# EAGLE design FV1 Touch (EAGLE 8.3.2)
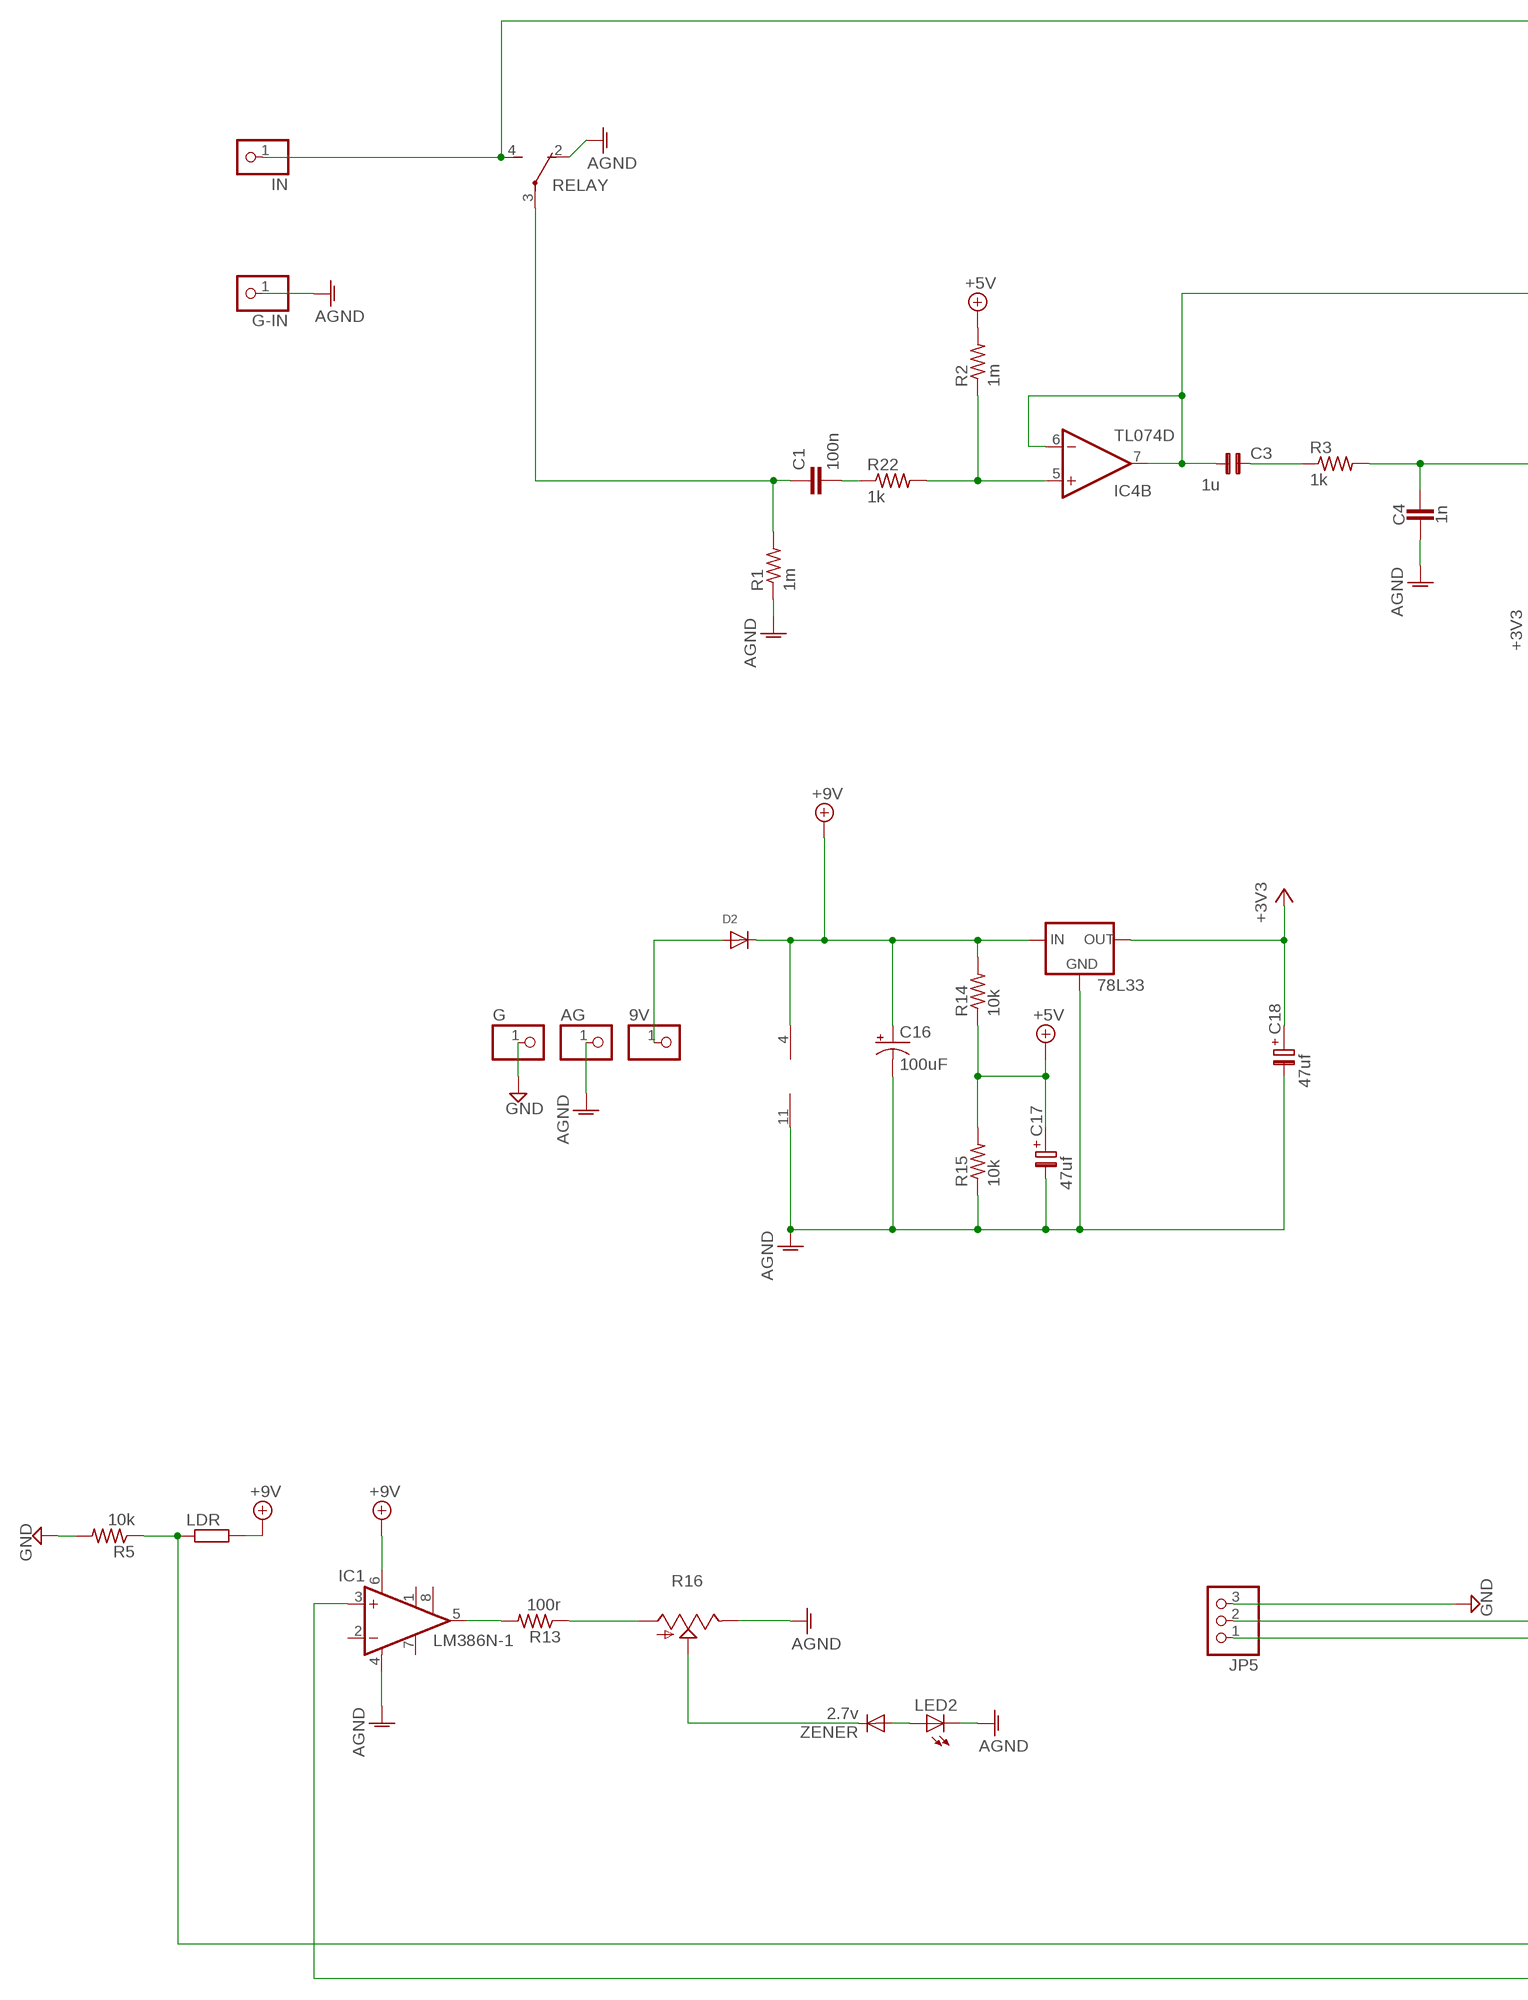
[diagram p0: schematic, sheet 1, part 1 of 2]
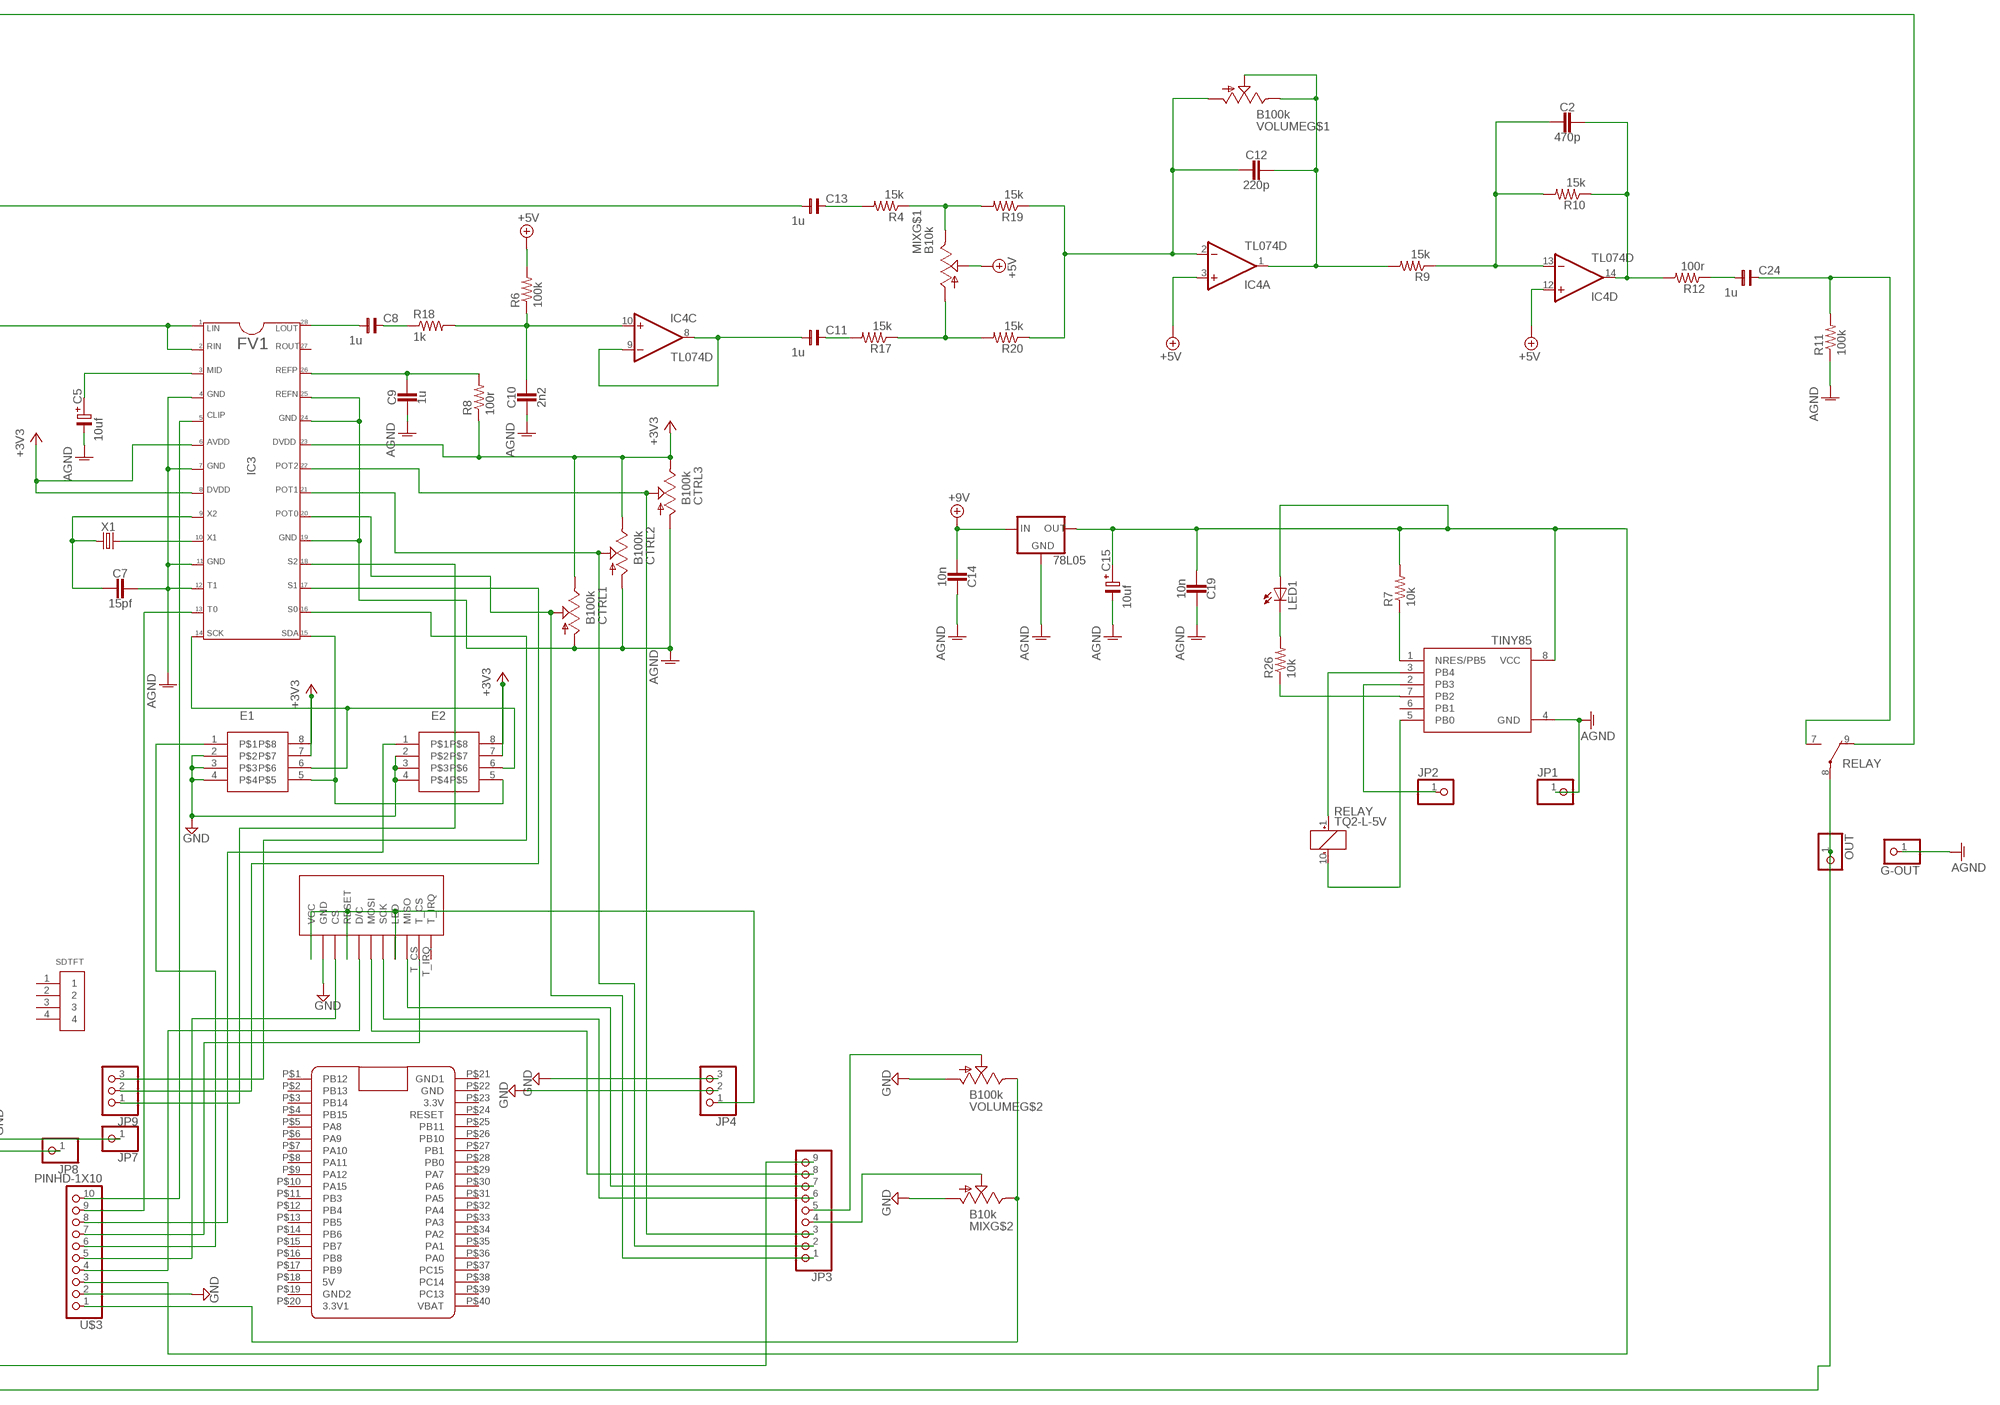
[diagram p1: schematic, sheet 1, part 2 of 2]

## Parts
9V  PINHD-1X1  [1X01]
78L05  78LXX-SOT89  [SOT89]
78L33  78LXX-SOT89  [SOT89]
AG  PINHD-1X1  [1X01]
C1  100n  C5/3  [C5B3]
C2  470p  CAP1206  [RESISTOR_C1206]
C3  1u  C-NP-5,0-7,5X3,0  [C5,0-7,5X3,0]
C4  1n  CAP1206  [RESISTOR_C1206]
C5  10uf  C-PR-SMD-SV-C  [SV-C]
C7  15pf  CAP1206  [RESISTOR_C1206]
C8  1u  C-NP-5,0-7,5X3,0  [C5,0-7,5X3,0]
C9  1u  CAP1206  [RESISTOR_C1206]
C10  2n2  CAP1206  [RESISTOR_C1206]
C11  1u  C-NP-5,0-7,5X3,0  [C5,0-7,5X3,0]
C12  220p  CAP1206  [RESISTOR_C1206]
C13  1u  C-NP-5,0-7,5X3,0  [C5,0-7,5X3,0]
C14  10n  CAP1206  [RESISTOR_C1206]
C15  10uf  C-PR-SMD-SV-C  [SV-C]
C16  100uF  100UF-POLAR-25V-20%(ELEC)  [PANASONIC_D]
C17  47uf  C-PR-SMD-SV-C  [SV-C]
C18  47uf  C-PR-SMD-SV-C  [SV-C]
C19  10n  CAP1206  [RESISTOR_C1206]
C24  1u  C-NP-5,0-7,5X3,0  [C5,0-7,5X3,0]
CTRL1  B100k  9MM_SNAP-IN_POT_  [9MM_SNAP-IN_POT]
CTRL2  B100k  9MM_SNAP-IN_POT_  [9MM_SNAP-IN_POT]
CTRL3  B100k  9MM_SNAP-IN_POT_  [9MM_SNAP-IN_POT]
D2  DIODESOD-123  [SOD-123]
E1  -EEPROM  [SOCKED-08]
E2  -EEPROM  [SOCKED-08]
G  PINHD-1X1  [1X01]
G-IN  PINHD-1X1  [1X01]
G-OUT  PINHD-1X1  [1X01]
IC1  LM386N-1  [DIL08]
IC3  FV1  [SO1C28]
IC4  TL074D  [SO14]
IN  PINHD-1X1  [1X01]
J1  SPI_TFT_DISPLAY_TOUCH  [SPI_DISPLAY_TOUCH]
JP1  PINHD-1X1CB  [1X01-CLEANBIG]
JP2  PINHD-1X1CB  [1X01-CLEANBIG]
JP3  PINHD-1X9  [1X09-BIG]
JP4  PINHD-1X3  [1X03]
JP5  PINHD-1X3  [1X03]
JP7  PINHD-1X1  [1X01]
JP8  PINHD-1X1  [1X01]
JP9  PINHD-1X3  [1X03]
LDR  R-EU_0204/5  [0204/5]
LED1  LED5MM  [LED5MM]
LED2  LED5MM  [LED5MM]
MIX  B10k  ALPHA-9MM-DUALPOT  [DUAL_9MM_SNAP-IN_POT]
OUT  PINHD-1X1  [1X01]
R1  1m  R-US_R0805  [R0805]
R2  1m  R-US_R0805  [R0805]
R3  1k  R-US_R0805  [R0805]
R4  15k  R-US_R0805  [R0805]
R5  10k  R-US_R0805  [R0805]
R6  100k  R-US_R0805  [R0805]
R7  10k  R-US_R0805  [R0805]
R8  100r  R-US_R0805  [R0805]
R9  15k  R-US_R0805  [R0805]
R10  15k  R-US_R0805  [R0805]
R11  100k  R-US_R0805  [R0805]
R12  100r  R-US_R0805  [R0805]
R13  100r  R-US_R0805  [R0805]
R14  10k  R-US_R0805  [R0805]
R15  10k  R-US_R0805  [R0805]
R16  TRIM_US-B25P  [B25P]
R17  15k  R-US_R0805  [R0805]
R18  1k  R-US_R0805  [R0805]
R19  15k  R-US_R0805  [R0805]
R20  15k  R-US_R0805  [R0805]
R22  1k  R-US_R0805  [R0805]
R26  10k  R-US_R0805  [R0805]
RELAY  TQ2-L-5V  TQ2-5V  [TQ2]
SDTFT  1X4-BIG  [1X04-BIG]
TINY85  ATTINY85-20P  [PDIP08_300MIL]
U$1  BLUE_PILL  [BLUE_PILL]
U$3  PINHD-1X10  [1X10-BIG]
VOLUME  B100k  ALPHA-9MM-DUALPOT  [DUAL_9MM_SNAP-IN_POT]
X1  CRYSTALPTH-2X6-KIT  [CRYSTAL-PTH-2X6-CYL-KIT]
ZENER  2.7v  SMALL_DIODEDO35-7  [DO35-7]

## Nets
+3V3: 78L33.1(OUT) C18.+ CTRL1.3(E) CTRL2.3(E) CTRL3.3(E) E1.7 E1.8 E2.7 E2.8 IC3.6 IC3.8 IC3.23 R8.1
+5V: C17.+ IC4.3(A:+IN) IC4.12(D:+IN) MIX.2(S) R2.2 R6.2 R14.1 R15.2
+9V: 78L05.3(IN) 78L33.3(IN) C14.2 C16.+ D2.C IC1.6(VS) IC4.4(P:V+) LDR.2 R14.2
AGND: 78L05.2(GND) 78L33.2(GND) AG.1 C4.2 C5.- C7.1 C9.2 C10.2 C14.1 C15.- C16.- C17.- C18.- C19.1 CTRL1.1(A) CTRL2.1(A) CTRL3.1(A) G-IN.1 G-OUT.1 IC1.4(GND) IC3.4 IC3.7 IC3.11 IC3.12 IC3.19 IC3.24 IC3.25 IC4.11(P:V-) JP1.1 LED2.K(C) R1.1 R11.1 R15.1 R16.E RELAY.2(1:O) TINY85.4(GND)
GND: E1.2 E1.3 E1.4 E2.2 E2.3 E2.4 G.1 J1.GND JP4.2 JP4.3 JP5.3 MIX.1B(A) R5.2 U$3.2 VOLUME.1B(A)
N$1: C1.2 R22.1
N$2: IC4.5(B:+IN) R2.1 R22.2
N$3: C3.1 C13.1 IC4.6(B:-IN) IC4.7(B:OUT)
N$4: C8.1 IC3.28
N$5: C4.1 IC3.1 IC3.2 R3.2
N$6: C8.2 R18.1
N$7: C3.2 R3.1
N$8: C10.1 IC4.10(C:+IN) R6.1 R18.2
N$9: C11.1 IC4.8(C:OUT) IC4.9(C:-IN)
N$10: C11.2 R17.2
N$11: MIX.1(A) R17.1 R20.2
N$12: C24.2 R11.2 RELAY.7(2:S)
N$13: MIX.3(E) R4.1 R19.2
N$14: C13.2 R4.2
N$15: C2.1 IC4.14(D:OUT) R10.1 R12.2
N$16: C24.1 R12.1
N$17: C1.1 R1.2 RELAY.3(1:P)
N$18: C12.2 IC4.2(A:-IN) R19.1 R20.1 VOLUME.1(A)
N$19: C2.2 IC4.13(D:-IN) R9.1 R10.2
N$20: C12.1 IC4.1(A:OUT) R9.2 VOLUME.2(S) VOLUME.3(E)
N$21: J1.CS U$3.5
N$22: J1.D/C U$3.4
N$23: J1.MOSI J1.T_MOSI(MOSI) JP3.8
N$24: C5.+ IC3.3
N$25: IC3.13 U$3.9
N$26: CTRL3.2(S) IC3.22 JP3.3
N$27: C7.2 IC3.9 X1.1
N$28: C9.1 IC3.26 R8.2
N$29: CTRL2.2(S) IC3.21 JP3.2
N$30: CTRL1.2(S) IC3.20 JP3.1
N$31: J1.SCK J1.T_SCK(SCK) JP3.6
N$32: J1.MISO J1.T_MISO(MISO) JP3.7
N$33: IC3.10 X1.2
N$34: J1.T_CS U$3.7
N$35: JP5.2 JP7.1
N$36: E1.6 E2.6 IC3.14
N$37: E1.5 E2.5 IC3.15
N$38: JP5.1 JP8.1
N$39: J1.LED J1.RESET J1.VCC JP4.1
N$40: IC3.17 JP9.2
N$41: 9V.1 D2.A
N$42: IC3.18 JP9.1
N$43: E1.1 U$3.6
N$44: JP3.4 MIX.2B(S)
N$45: 78L05.1(OUT) C15.+ C19.2 LED1.A R7.2 TINY85.8(VCC) U$3.3
N$46: RELAY.1(_:+) TINY85.3(PB4)
N$47: R7.1 TINY85.1(NRES/PB5)
N$48: RELAY.10(_:-) TINY85.5(PB0)
N$49: JP2.1 TINY85.2(PB3)
N$50: R26.1 TINY85.7(PB2)
N$51: LED1.K(C) R26.2
N$52: IN.1 RELAY.4(1:S) RELAY.9(2:O)
N$53: IC1.3(+IN) OUT.1 RELAY.8(2:P)
N$54: JP3.5 VOLUME.2B(S)
N$55: IC3.16 JP9.3
N$56: MIX.3B(E) U$3.1 VOLUME.3B(E)
N$57: R16.S ZENER.C
N$59: E2.1 U$3.8
N$80: IC3.5 U$3.10
N$82: IC1.5(OUT) R13.2
N$83: R13.1 R16.A
N$84: LED2.A ZENER.A
N$87: JP3.9 LDR.1 R5.1
Unconnected: IC1.1(GAIN) IC1.2(-IN) IC1.7(BYPASS) IC1.8(GAIN) IC3.27 J1.T_IRQ SDTFT.1 SDTFT.2 SDTFT.3 SDTFT.4 TINY85.6(PB1) U$1.P$1(PB12) U$1.P$2(PB13) U$1.P$3(PB14) U$1.P$4(PB15) U$1.P$5(PA8) U$1.P$6(PA9) U$1.P$7(PA10) U$1.P$8(PA11) U$1.P$9(PA12) U$1.P$10(PA15) U$1.P$11(PB3) U$1.P$12(PB4) U$1.P$13(PB5) U$1.P$14(PB6) U$1.P$15(PB7) U$1.P$16(PB8) U$1.P$17(PB9) U$1.P$18(5V) U$1.P$19(GND2) U$1.P$20(3.3V1) U$1.P$22(GND) U$1.P$23(3.3V) U$1.P$24(RESET) U$1.P$25(PB11) U$1.P$26(PB10) U$1.P$27(PB1) U$1.P$28(PB0) U$1.P$29(PA7) U$1.P$30(PA6) U$1.P$31(PA5) U$1.P$32(PA4) U$1.P$33(PA3) U$1.P$34(PA2) U$1.P$35(PA1) U$1.P$36(PA0) U$1.P$37(PC15) U$1.P$38(PC14) U$1.P$39(PC13) U$1.P$40(VBAT)

## Power pins joined to a net without a drawn wire
GND1: U$1.P$21(GND1)

## Library data of the parts
9V AG G G-IN G-OUT IN JP1 JP2 JP7 JP8 OUT = adafruit:PINHD-1X1: Pin header 1x1 for 0.1" spacing With round pins
78L05 78L33 = v-reg-3:78LXX: VOLTAGE REGULATOR
C1 = capacitor-wima:C: CAPACITOR naming: grid - package width
C2 C4 C7 C9 C10 C12 C14 C19 = SMD:CAP
C3 C8 C11 C13 C24 = cap-pan40:C-NP: NON-POLARIZED FILM/CHIP
C5 C15 C17 C18 = cap-pan40:C-PR: POLARIZED ELECTROLYTIC/TANTALUM
C16 = SparkFun-Capacitors:100UF-POLAR: 100µF polarized capacitors A capacitor is a passive two-terminal electrical component used to store electrical energy temporarily in an electric field.; PROD_ID: CAP-12547
CTRL1-CTRL3 = MusicThingModular:9MM_SNAP-IN_POT: 9mm vertical snap-in pot, Alpha / Panasonic style
D2 = adafruit:DIODE: Diode SMADIODE - SMA Surface Mount Package 20V 1A Schottky Diode Digikey: 641-1014-6-ND DO-1N4148 - Through Hole Small Current Diode SOD-123 20V 1 A (.5mV Vf) Schottky Diode - Digikey: MBRX120TPMSCT-ND SOD-323 10V 570mA (.38mV Vf, 3ns) Schottky Diode - Digikey: ZLLS410CT-ND SOD-523 30V 30mA Schottky Diode (RB751S-40TE61) - Digikey: RB751S-40TE61CT-ND SOT23-R/W - SOT23 Package (R = Solder Paste/Reflow Ovens, W = Hand-Soldering) BAT54Film 40V 300mA - Digikey: 497-7162-1-ND
E1 E2 = tango:-EEPROM
IC1 = linear:LM386?-*: Low Voltage Audio Power Amplifier Source: http://cache.national.com/ds/LM/LM386.pdf
IC3 = integrated circuits:FV1
IC4 = gm-ics:TL074: OP AMP
J1 = kanflo:SPI_TFT_DISPLAY_TOUCH: SPI TFT Display with touch Connector for the cheap 2.4"/2.8" Serial SPI TFT displays with touch found on eBay.
JP3 = adafruit:PINHD-1X9: Pin header 1x10 0.1" spacing With round pins
JP4 JP5 JP9 = adafruit:PINHD-1X3: PIN HEADER
LDR = resistor:R-EU_: RESISTOR, European symbol
LED1 LED2 = adafruit:LED: LED OSRAM: - CHIPLED LG R971, LG N971, LY N971, LG Q971, LY Q971, LO R971, LY R971 LH N974, LH R974 LS Q976, LO Q976, LY Q976 LO Q996 - Hyper CHIPLED LW Q18S LB Q993, LB Q99A, LB R99A - SideLED LS A670, LO A670, LY A670, LG A670, LP A670 LB A673, LV A673, LT A673, LW A673 LH A674 LY A675 LS A676, LA A676, LO A676, LY A676, LW A676 LS A679, LY A679, LG A679 - Hyper Micro SIDELED® LS Y876, LA Y876, LO Y876, LY Y876 LT Y87S - SmartLED LW L88C, LW L88S LB L89C, LB L89S, LG L890 LS L89K, LO L89K, LY L89K LS L896, LA L896, LO L896, LY L896 - TOPLED LS T670, LO T670, LY T670, LG T670, LP T670 LSG T670, LSP T670, LSY T670, LOP T670, LYG T670 LG T671, LOG T671, LSG T671 LB T673, LV T673, LT T673, LW T673 LH T674 LS T676, LA T676, LO T676, LY T676, LB T676, LH T676, LSB T676, LW T676 LB T67C, LV T67C, LT T67C, LS T67K, LO T67K, LY T67K, LW E67C LS E67B, LA E67B, LO E67B, LY E67B, LB E67C, LV E67C, LT E67C LW T67C LS T679, LY T679, LG T679 LS T770, LO T770, LY T770, LG T770, LP T770 LB T773, LV T773, LT T773, LW T773 LH T774 LS E675, LA E675, LY E675, LS T675 LS T776, LA T776, LO T776, LY T776, LB T776 LHGB T686 LT T68C, LB T68C - Hyper Mini TOPLED® LB M676 - Mini TOPLED Santana® LG M470 LS M47K, LO M47K, LY M47K Source: http://www.osram.convergy.de/
MIX VOLUME = My Library:ALPHA-9MM-DUALPOT: 9mm vertical snap-in pot, Alpha / Panasonic style, with a connection to the metal chassis for grounding
R1-R15 R17-R20 R22 R26 = resistor:R-US_: RESISTOR, American symbol
R16 = pot:TRIM_US-: POTENTIOMETER
RELAY = relay:TQ2?*: LOW PROFILE 2 FORM C RELAY NAiS Source: http://www.mew-europe.com/.. en_ds_61020_0001.pdf Source: http://www.mew-europe.com/.. en_ds_61020_0004.pdf
SDTFT = adafruit:1X4: 4-pin connector
TINY85 = _hhn_attiny25_45_85:ATTINY85*: ATMEL ATtiny 85 Packages: P = PDIP 08 30mil S = SOIC 08 EIAJ 208mil Technologies Note: for complete ordering code (temp. range, finish, tape&reel etc.) see www.atmel.com • Supply Voltage: V = (1.8…5.5)V | [blank] = (2.7…5.5)V • Speed: 10 = 10 MHz | 20 = 20 MHz Author: Dipl.-Ing. FH Rainer Bayer HHN Hochschule Heilbronn (Heilbronn University), rainer.bayer@hs-heilbronn.de Ingenieurbüro ing-rb, mail@ing-rb.de
U$1 = BluePill:BLUE_PILL
U$3 = adafruit:PINHD-1X10: Pin header 1x10 0.1" spacing With round pins
X1 = SparkFun-Clocks:CRYSTAL: Crystals (Generic) These are passive quartz crystals, which can be used as a clock source for a microcontroller. Crystal's are two-terminal devices. They require external "load" capacitors to generate an oscillating signal.
ZENER = MusicThingModular:SMALL_DIODE: Small Signal Diode

## Net classes
0 default: width 0.254 mm, drill 0.508 mm, clearance 0.254 mm

## Board
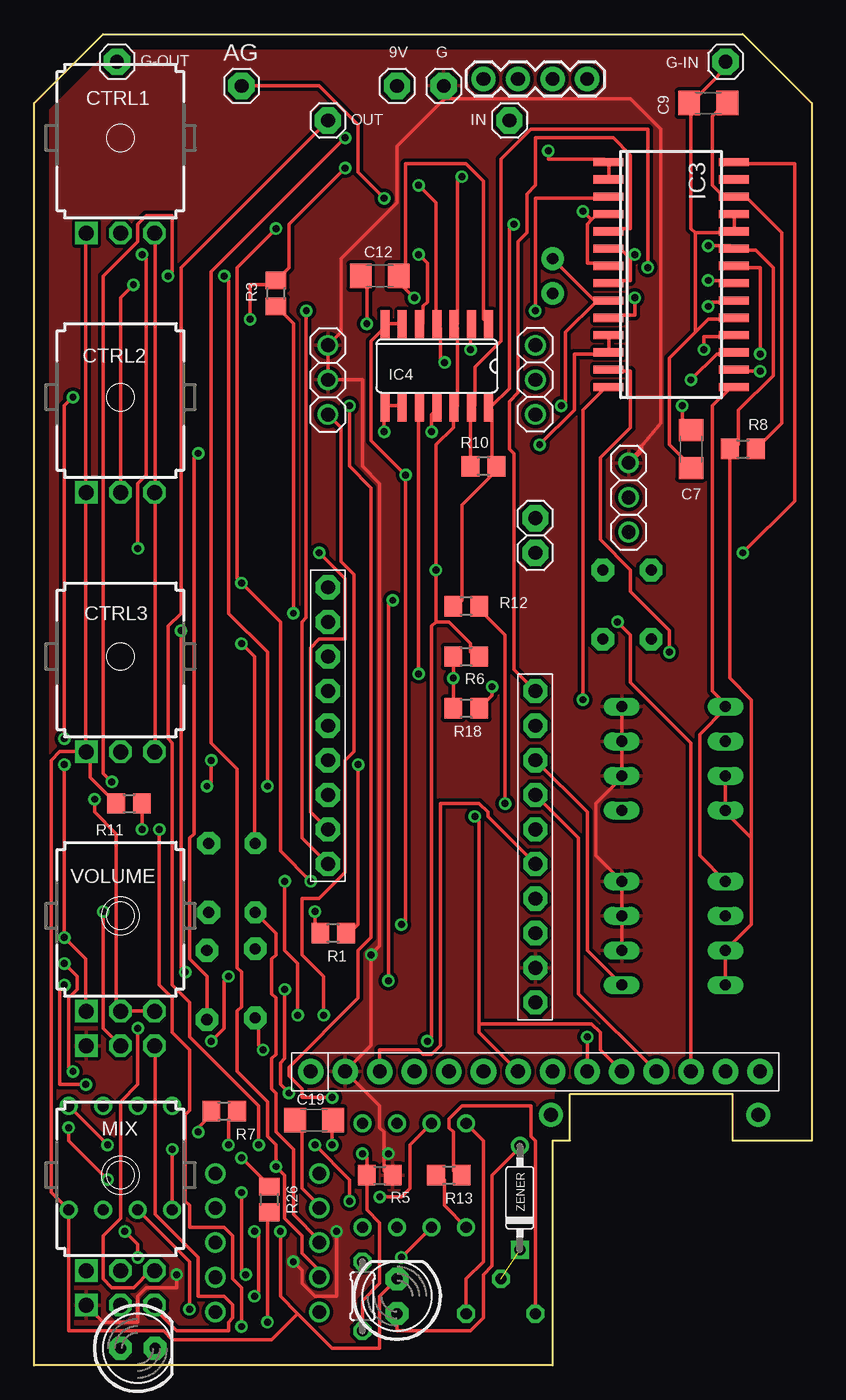
[diagram p2: board, top side]
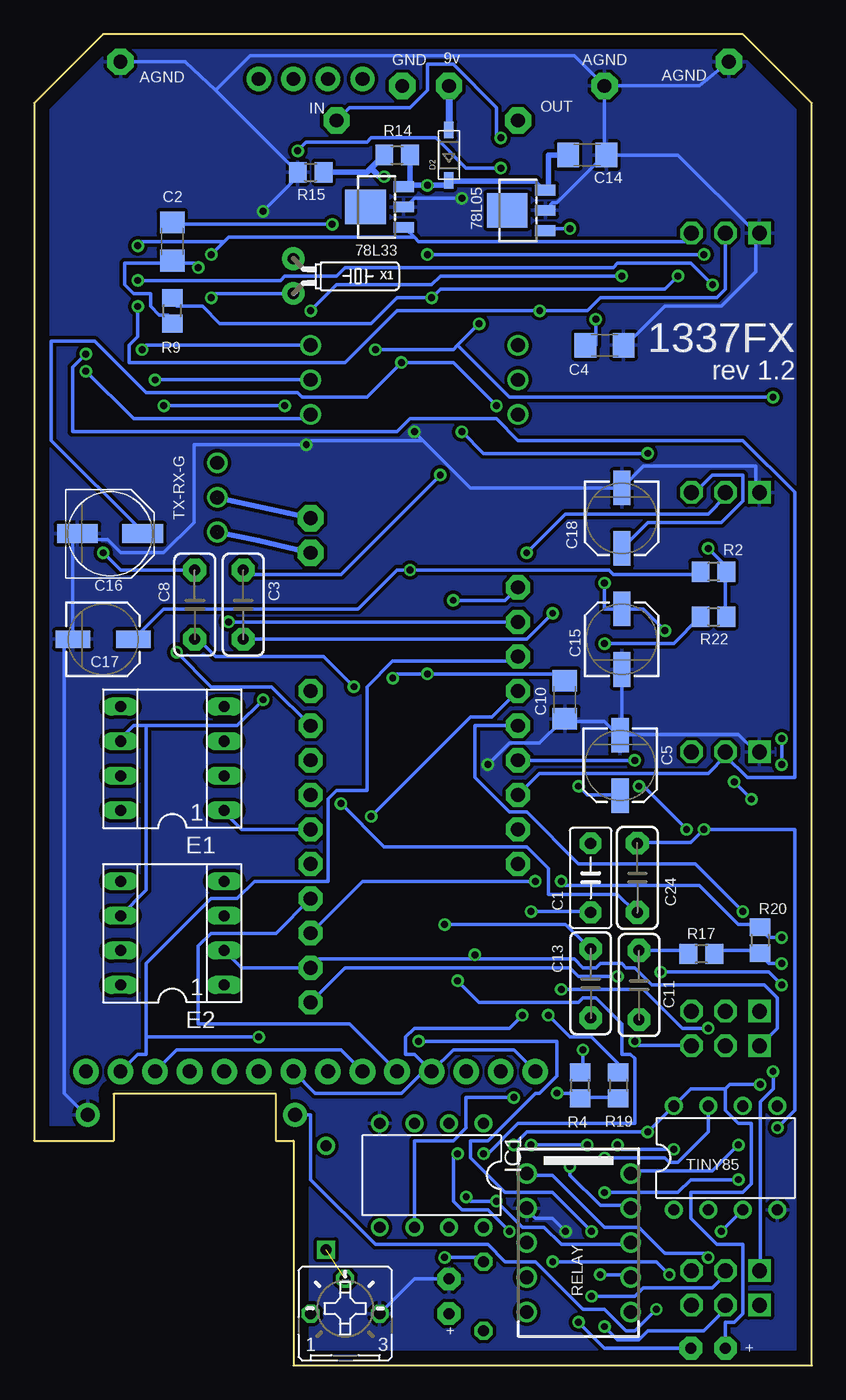
[diagram p3: board, bottom side, seen from below]

Size 57.15 x 97.79 mm. Coordinates in mm from the lower left corner, seen from the top.
Outline: 57.15,92.71 57.15,16.51 51.31,16.51 51.31,19.94 39.37,19.94 39.37,16.51 38.1,16.51 38.1,0 0,0 0,92.71 5.08,97.79 52.07,97.79 57.15,92.71
Copper layers (1*16): Top 0.035mm / dielectric 1.5mm / Bottom 0.035mm
Design rules "default": minimum track width 6mil, minimum drill 0.35mm, track to track 6mil, track to pad 6mil, pad to pad 6mil, via to via 6mil, smd to smd 6mil, copper to edge 40mil, drill to drill 6mil, minimum pad ring 10mil, minimum via ring 8mil, stop-mask expansion 4mil, vias tented up to drill 0mil, thermal gap 10mil

### Footprints (pad centres in the part's own frame; a part is rotated, then mirrored left to right if it is on the bottom)
1X01 = drill 1.016 pad 1.93 octagon: 1 0,0
SOT89 = smd 0.8 x 1.5: 1 -1.5,-1.75; 2 0,-1.75; 3 1.5,-1.75 | smd 2.5 x 3: 4 0,1.05
C5B3 = drill 0.813 pad 1.6 octagon: 1 -2.54,0; 2 2.54,0
RESISTOR_C1206 = smd 1.6 x 1.8: 1 -1.4,0; 2 1.4,0
C5,0-7,5X3,0 = drill 0.813 pad 1.676 octagon: 1 -2.54,0; 2 2.54,0
SV-C = smd 2.54 x 1.27: + -2.223,0; - 2.223,0
PANASONIC_D = smd 3 x 1.4: + 2.4,0; - -2.4,0
9MM_SNAP-IN_POT = drill 1.1 square: 1 -2.5,-7 | drill 1.1 octagon: 2 0,-7; 3 2.5,-7
SOD-123 = smd 1.2 x 0.7: A 1.85,0; C -1.85,0
SOCKED-08 = drill 0.813 long: 1 -3.81,-3.81; 2 -1.27,-3.81; 3 1.27,-3.81; 4 3.81,-3.81; 5 3.81,3.81; 6 1.27,3.81; 7 -1.27,3.81; 8 -3.81,3.81
DIL08 = drill 0.813 pad 1.27: 1 -3.81,-3.81; 2 -1.27,-3.81; 3 1.27,-3.81; 4 3.81,-3.81; 5 3.81,3.81; 6 1.27,3.81; 7 -1.27,3.81; 8 -3.81,3.81
SO1C28 = smd 0.6 x 2.2: 1 -8.24,-4.79; 2 -6.97,-4.79; 3 -5.7,-4.79; 4 -4.43,-4.79; 5 -3.16,-4.79; 6 -1.89,-4.79; 7 -0.62,-4.79; 8 0.65,-4.79; 9 1.92,-4.79; 10 3.19,-4.79; 11 4.46,-4.79; 12 5.73,-4.79; 13 7,-4.79; 14 8.27,-4.79; 15 8.27,4.41; 16 7,4.41; 17 5.73,4.41; 18 4.46,4.41; 19 3.19,4.41; 20 1.92,4.41; 21 0.65,4.41; 22 -0.62,4.41; 23 -1.89,4.41; 24 -3.16,4.41; 25 -4.43,4.41; 26 -5.7,4.41; 27 -6.97,4.41; 28 -8.24,4.41
SO14 = smd 0.66 x 2.032: 1 -3.81,-3.073; 2 -2.54,-3.073; 3 -1.27,-3.073; 4 0,-3.073; 5 1.27,-3.073; 6 2.54,-3.073; 7 3.81,-3.073; 8 3.81,3.073; 9 2.54,3.073; 10 1.27,3.073; 11 0,3.073; 12 -1.27,3.073; 13 -2.54,3.073; 14 -3.81,3.073
SPI_DISPLAY_TOUCH = drill 1.016 pad 1.88: CS 0,7.62; D/C 0,2.54; GND 0,10.16; LED 0,-5.08; MISO 0,-7.62; MOSI 0,0; RESET 0,5.08; SCK 0,-2.54; T_CS 0,-12.7; T_IRQ 0,-20.32; T_MISO 0,-17.78; T_MOSI 0,-15.24; T_SCK 0,-10.16; VCC 0,12.7
1X01-CLEANBIG = drill 1.016 pad 1.778: 1 0,0
1X09-BIG = drill 1.016 pad 1.778 octagon: 1 -10.16,0; 2 -7.62,0; 3 -5.08,0; 4 -2.54,0; 5 0,0; 6 2.54,0; 7 5.08,0; 8 7.62,0; 9 10.16,0
1X03 = drill 1.016: 1 -2.54,0; 2 0,0; 3 2.54,0
0204/5 = drill 0.813 octagon: 1 -2.54,0; 2 2.54,0
LED5MM = drill 0.813 pad 1.676 octagon: A -1.27,0; K 1.27,0
DUAL_9MM_SNAP-IN_POT = drill 1.1 square: 1 -2.5,-7; 1B -2.5,-9.54 | drill 1.1 octagon: 2 0,-7; 2B 0,-9.54; 3 2.5,-7; 3B 2.5,-9.54
R0805 = smd 1.3 x 1.5: 1 -0.95,0; 2 0.95,0
B25P = drill 0.813 octagon: A -2.54,0; E 2.54,0; S 0,2.54
TQ2 = drill 1: 1 -5.08,-3.81; 2 -2.54,-3.81; 3 0,-3.81; 4 2.54,-3.81; 5 5.08,-3.81; 6 5.08,3.81; 7 2.54,3.81; 8 0,3.81; 9 -2.54,3.81; 10 -5.08,3.81
1X04-BIG = drill 1.016 pad 1.778: 1 0,0; 2 2.54,0; 3 5.08,0; 4 7.62,0
PDIP08_300MIL = drill 0.813: 1 -3.81,-3.81; 2 -1.27,-3.81; 3 1.27,-3.81; 4 3.81,-3.81; 5 3.81,3.81; 6 1.27,3.81; 7 -1.27,3.81; 8 -3.81,3.81
BLUE_PILL = drill 0.8 long: P$1 -7.62,15.24; P$2 -7.62,12.7; P$3 -7.62,10.16; P$4 -7.62,7.62; P$5 -7.62,5.08; P$6 -7.62,2.54; P$7 -7.62,0; P$8 -7.62,-2.54; P$9 -7.62,-5.08; P$10 -7.62,-7.62; P$11 -7.62,-10.16; P$12 -7.62,-12.7; P$13 -7.62,-15.24; P$14 -7.62,-17.78; P$15 -7.62,-20.32; P$16 -7.62,-22.86; P$17 -7.62,-25.4; P$18 -7.62,-27.94; P$19 -7.62,-30.48; P$20 -7.62,-33.02; P$21 7.62,15.24; P$22 7.62,12.7; P$23 7.62,10.16; P$24 7.62,7.62; P$25 7.62,5.08; P$26 7.62,2.54; P$27 7.62,0; P$28 7.62,-2.54; P$29 7.62,-5.08; P$30 7.62,-7.62; P$31 7.62,-10.16; P$32 7.62,-12.7; P$33 7.62,-15.24; P$34 7.62,-17.78; P$35 7.62,-20.32; P$36 7.62,-22.86; P$37 7.62,-25.4; P$38 7.62,-27.94; P$39 7.62,-30.48; P$40 7.62,-33.02
1X10-BIG = drill 1.016 pad 1.778 octagon: 1 -11.43,0; 2 -8.89,0; 3 -6.35,0; 4 -3.81,0; 5 -1.27,0; 6 1.27,0; 7 3.81,0; 8 6.35,0; 9 8.89,0; 10 11.43,0
CRYSTAL-PTH-2X6-CYL-KIT = drill 0.813 pad 1.676: 1 -1.27,0; 2 1.27,0
DO35-7 = drill 0.813: A 3.81,0 | drill 0.813 square: C -3.81,0

### Placement (x,y rotation side)
9V  26.67,93.98 0 top
78L05  21.34,84.84 90 bottom
78L33  31.75,85.09 90 bottom
AG  15.24,93.98 0 top
C1  16.26,35.81 90 bottom
C2  46.99,82.55 270 bottom
C3  41.78,55.88 270 bottom
C4  15.24,74.93 0 bottom
C5  14.1,44.07 90 bottom
C7  48.26,67.31 90 top
C8  45.34,55.88 270 bottom
C9  49.53,92.71 180 top
C10  18.16,48.9 270 bottom
C11  12.7,27.94 90 bottom
C12  25.4,80.01 180 top
C13  16.26,28.07 270 bottom
C14  16.51,88.9 180 bottom
C15  13.97,53.34 270 bottom
C16  51.56,61.09 0 bottom
C17  52.07,53.34 180 bottom
C18  13.97,62.23 90 bottom
C19  20.57,18.03 0 top
C24  12.83,35.81 90 bottom
CTRL1  6.35,90.17 0 top
CTRL2  6.35,71.12 0 top
CTRL3  6.35,52.07 0 top
D2  26.67,88.9 90 bottom
E1  46.99,44.58 90 bottom
E2  46.99,31.75 90 bottom
G  30.1,93.98 0 top
G-IN  50.8,95.76 0 top
G-OUT  6.1,95.76 0 top
IC1  27.94,13.97 180 bottom
IC3  46.99,80.14 270 top
IC4  29.59,73.41 180 top
IN  34.92,91.44 0 top
J1  33.02,21.59 90 top
JP1  53.21,18.41 270 top
JP2  37.97,18.41 270 top
JP3  21.59,46.99 90 top
JP4  21.59,72.39 90 top
JP5  43.69,63.75 90 top
JP7  36.83,62.23 270 top
JP8  36.83,59.69 270 top
JP9  36.83,72.39 270 top
LDR  24.13,5.08 90 top
LED1  7.62,1.27 0 top
LED2  26.67,5.08 90 top
MIX  6.35,13.97 0 top
OUT  21.59,91.44 0 top
R1  21.97,31.75 180 top
R2  7.24,58.29 180 bottom
R3  17.78,78.74 90 top
R4  17.02,20.57 90 bottom
R5  25.4,13.97 0 top
R6  31.75,52.07 0 top
R7  13.97,18.67 180 top
R8  52.07,67.31 0 top
R9  46.99,77.47 90 bottom
R10  33.02,66.04 180 top
R11  6.99,41.27 0 top
R12  31.75,55.75 180 top
R13  30.48,13.97 180 top
R14  30.48,88.9 0 bottom
R15  36.83,87.63 0 bottom
R16  34.29,3.81 0 bottom
R17  8.13,30.23 180 bottom
R18  31.75,48.26 180 top
R19  14.22,20.57 270 bottom
R20  3.81,31.24 270 bottom
R22  7.24,54.99 0 bottom
R26  17.27,12.19 270 top
RELAY  17.14,9.02 270 bottom
SDTFT  33.02,94.49 0 top
TINY85  6.35,15.24 0 bottom
U$1  -19.05,33.02 0 top  (outside the outline)
U$3  36.83,38.1 90 top
VOLUME  6.35,33.02 0 top
X1  38.1,80.01 270 bottom
ZENER  35.69,12.32 90 top

### Tracks (layer width: path | path; a pad name or v marks a point on that pad's centre or on a via)
+3V3  (via drill 0.51)
  Top 0.254: E2.8 E2.7 52.7,32.38 52.7,38.73 | E1.7 E1.8 50.8,40.64 52.7,38.73 | 52.7,38.73 52.7,48.9 51.12,50.48 R8.1 51.44,67.31 51.75,67.63 51.75,70.17 54.29,72.71 54.29,80.64 53.02,81.92 51.44,81.92 IC3.23 51.12,82.23 v49.53,82.23 | CTRL3.3 8.89,45.09 8.89,63.82 CTRL2.3 8.89,64.14 8.89,82.87 CTRL1.3 | 43.81,81.28 43.81,79.69 42.23,79.69 IC3.8 | 43.81,81.28 43.18,81.92 42.23,81.92 IC3.6 | v44.13,81.6 43.81,81.28
  Bottom 0.254: C18.+ 12.06,61.91 6.67,61.91 5.08,63.5 5.08,65.41 7.3,65.41 8.57,64.14 CTRL2.3 | 29.21,82.87 28.89,82.55 9.21,82.55 8.89,82.87 CTRL1.3 | 29.21,82.87 29.84,83.5 78L33.1 | 43.18,82.55 42.86,82.87 29.21,82.87 | 43.18,82.55 v44.13,81.6 | v49.53,82.23 49.21,82.55 43.18,82.55
+5V  (via drill 0.51)
  Top 0.254: 29.53,54.61 30.48,54.61 32.07,53.02 32.07,52.39 32.38,52.07 R6.2 | 29.53,54.61 v29.53,58.42 29.53,67.63 30.8,68.9 30.8,70.17 IC4.12 31.11,70.48 31.11,76.2 IC4.3 31.11,76.52 31.11,87 v31.43,87.31 | v16.19,5.08 16.51,5.4 16.51,9.53 v16.19,9.84 | v28.89,23.81 29.21,24.13 29.21,54.29 29.53,54.61
  Bottom 0.254: C17.+ 47.62,55.56 33.34,55.56 30.48,58.42 v29.53,58.42 14.92,58.42 14.61,58.1 8.26,58.1 R2.2 | R14.1 | v16.19,5.08 13.02,5.08 12.38,5.71 7.3,5.71 6.35,6.67 MIX.2 | v16.19,9.84 19.05,12.7 22.54,12.7 25.08,15.24 25.08,16.51 23.81,16.51 20.32,20 20,20 18.73,21.27 18.73,23.81 v28.89,23.81
  Bottom 0.406: 32.38,87.95 32.7,87.63 R15.2 | 32.38,87.95 R14.1 | 32.38,87.95 31.75,87.31 v31.43,87.31
+9V  (via drill 0.51)
  Top 0.254: IC1.6 v26.99,7.94 | v28.26,86.68 29.53,85.41 29.53,76.52 IC4.4 29.84,76.2 29.84,73.98 v30.16,73.66 | v21.91,19.69 19.68,19.69 19.68,20.32 18.73,21.27 18.73,21.91 23.81,26.99 23.81,30.48 24.77,31.43 24.77,64.45 23.18,66.04 v23.18,70.48
  Bottom 0.254: LDR.2 24.45,7.94 v26.99,7.94 | 19.37,86.36 78L05.3 19.68,86.36 20.32,87 | 26.99,86.68 26.67,87 D2.C | R14.2 | C16.+ 49.21,61.28 55.88,67.95 55.88,75.25 52.7,75.25 48.9,71.44 37.78,71.44 37.47,71.12 32.7,71.12 v30.16,73.66 26.35,73.66 v23.18,70.48 | IC1.6 29.21,16.51 26.35,16.51 25.4,17.46 25.4,19.69 v21.91,19.69 | 29.84,86.68 29.53,86.68 78L33.3 29.84,86.68
  Bottom 0.406: 19.37,86.36 19.37,88.9 C14.2 | 26.99,86.68 v28.26,86.68 29.53,86.68 R14.2 | 26.67,87 20.32,87
AGND  (via drill 0.51)
  Top 0.254: IC3.25 51.44,84.45 51.44,83.5 IC3.24 51.12,83.19 48.58,83.19 | 48.58,75.88 49.53,76.84 51.12,76.84 IC3.19 | 48.58,75.88 46.67,73.98 46.67,67.63 48.26,66.04 C7.1 | 48.58,75.88 48.58,83.19 | 40.96,84.14 41.27,84.45 41.91,84.45 IC3.4 | 40.96,84.14 40.64,83.82 40.64,80.96 41.91,80.96 IC3.7 | 48.26,92.71 50.16,94.61 50.67,95.25 G-IN.1 | v40.32,84.77 40.96,84.14 | 48.58,83.19 48.26,83.5 48.26,92.71 | 48.26,92.71 C9.2 | v25.72,85.72 23.81,87.63 23.81,91.12 20.95,93.98 AG.1 | C19.1 19.37,17.78 19.68,17.46 19.68,13.02 20.95,11.75 RELAY.2 | IC1.4 33.02,16.51 33.02,7.62 31.75,6.35 R16.E | v18.1,9.84 18.1,5.08 19.37,3.81 | 19.37,3.81 21.91,1.27 25.4,1.27 25.4,5.08 LED2.K | v23.81,44.13 23.81,32.38 23.18,31.75 R1.1 | R11.1 4.13,43.18 4.13,44.77 CTRL3.1 3.81,45.09 | 3.81,45.09 1.91,45.09 1.27,44.45 1.27,12.7 TINY85.4 2.54,2.54 9.53,2.54 10.16,1.9 17.46,1.9 19.37,3.81 | IC3.11 42.23,75.56 42.23,74.61 IC3.12 41.91,74.3 39.69,74.3 39.69,70.17 v37.15,67.63 | v29.21,68.58 29.21,69.85 29.53,70.17 IC4.11 | 3.81,45.09 3.81,63.82 CTRL2.1 3.81,64.14 3.81,82.87 CTRL1.1
  Bottom 0.254: 43.81,93.66 46.04,95.76 G-IN.1 | 43.81,93.66 R15.1 37.47,87.63 v40.32,84.77 | C4.2 13.65,74.93 10.79,77.79 6.67,77.79 4.13,80.33 4.13,82.87 CTRL1.1 4.13,83.19 9.84,88.9 C14.1 15.24,88.9 | 15.24,88.9 18.73,85.41 19.05,85.41 19.37,85.09 78L05.2 | v25.72,85.72 29.21,85.72 29.84,85.09 78L33.2 | G-OUT.1 8.26,93.98 AG.1 | AG.1 15.24,88.9 | 43.81,93.66 41.27,96.2 17.46,96.2 AG.1 | R16.E 29.21,6.35 LED2.K | v18.1,9.84 19.05,10.79 20.32,10.79 20.95,11.43 RELAY.2 | v23.81,44.13 22.23,45.72 20,45.72 18.41,47.31 C10.2 18.1,47.31 15.24,47.31 14.29,46.36 C5.- 13.97,46.36 | 13.97,46.36 C15.- | 13.97,46.36 5.4,46.36 4.13,45.09 CTRL3.1 | JP1.1 53.34,18.41 54.93,20 54.93,53.34 C17.- 54.29,60.96 53.98,60.96 C16.- 53.66,60.96 53.34,60.64 51.75,60.64 50.8,59.69 47.62,59.69 45.4,61.91 45.4,67.63 v37.15,67.63 36.83,67.95 28.57,67.95 | 28.57,67.95 25.08,64.45 C18.- 12.38,66.04 4.13,66.04 4.13,64.14 CTRL2.1 | 28.57,67.95 v29.21,68.58
  pour Bottom: 0,92.71 0,0 38.1,0 38.1,16.51 39.37,16.51 39.37,19.94 51.31,19.94 51.31,16.64 51.44,16.51 57.15,16.51 57.15,92.71 52.07,97.79 5.08,97.79
GND  (via drill 0.51)
  Top 0.254: 44.58,67.44 46.04,69.22 46.04,90.81 43.81,93.03 30.16,93.03 | 30.16,93.03 30.16,93.98 G.1 30.16,93.03 | 30.16,93.03 26.67,89.53 26.67,85.41 22.54,81.28 22.54,75.88 JP4.3 JP4.2 24.13,72.39 24.13,66.04 25.4,64.77 25.4,30.8 v24.77,30.16 24.77,23.5 J1.GND 25.4,19.05 25.4,17.46 25.72,17.14 25.72,15.56 | 25.72,15.56 25.72,14.29 26.04,13.97 R5.2 | v10.48,6.67 10.48,5.71 8.26,5.71 7.62,5.08 7.62,3.17 5.08,3.17 4.13,4.13 MIX.1B | v19.05,7.62 19.68,6.98 19.68,6.03 20.64,5.08 22.23,5.08 v22.23,9.84 | 25.72,15.56 v26.04,15.56 | E1.4 E1.3 E1.2 43.18,43.18 41.27,41.27 41.27,37.47 E2.4 E2.3 E2.2
  Top 0.406: 44.58,67.44 44.58,67.18 JP5.3
  Bottom 0.254: v10.48,6.67 11.43,7.62 v19.05,7.62 | v22.23,9.84 23.81,11.43 25.72,11.43 26.35,12.06 26.35,15.56 v26.04,15.56 | 24.77,29.84 36.2,29.84 U$3.2 41.91,29.21 E2.2 | 24.77,29.84 17.46,29.84 16.83,29.21 15.88,29.21 15.56,29.53 13.97,29.53 13.65,29.21 13.02,29.21 11.75,27.94 3.49,27.94 2.54,26.99 2.54,24.77 3.81,23.5 VOLUME.1B | 24.77,29.84 v24.77,30.16
  pour Top: 0,92.71 0,0 38.1,0 38.1,16.51 39.37,16.51 39.37,19.94 51.31,19.94 51.31,16.51 57.15,16.51 57.15,92.71 52.07,97.79 5.08,97.79
N$1  (via drill 0.51)
  Top 0.254: v15.24,53.02 16.19,52.07 16.19,38.42 C1.2
  Bottom 0.254: v15.24,53.02 10.16,53.02 8.26,54.93 R22.1
N$2  (via drill 0.51)
  Top 0.254: v28.26,81.6 28.89,80.96 28.89,78.11 28.57,77.79 28.57,76.52 IC4.5 | v7.94,81.6 8.26,81.28 8.26,65.41 7.62,64.77 v7.62,60.01
  Bottom 0.254: R22.2 6.35,55.25 6.35,58.1 R2.1 6.03,58.42 v7.62,60.01 | v7.94,81.6 v28.26,81.6
N$3  (via drill 0.51)
  Top 0.254: IC4.6 26.99,76.52 26.04,76.52 IC4.7 25.72,76.2 24.77,75.25 24.77,67.95 v27.3,65.41 27.3,32.7 v26.99,32.38
  Bottom 0.254: v27.3,65.41 34.61,58.1 41.27,58.1 41.59,58.42 C3.1 | v26.99,32.38 18.1,32.38 16.51,30.8 C13.1
N$4  (via drill 0.51)
  Top 0.254: v52.07,59.69 55.88,63.5 55.88,88.27 51.44,88.27 IC3.28
  Bottom 0.254: v52.07,59.69 50.8,58.42 C8.1
N$5  (via drill 0.51)
  Top 0.254: IC3.2 42.23,87.31 42.23,88.27 IC3.1 41.91,88.58 37.78,88.58 v37.78,89.22 | v15.88,76.84 15.88,79.38 17.78,79.38 R3.2 18.73,80.64 18.73,83.82 v22.86,87.95
  Bottom 0.254: v15.88,76.84 15.88,74.93 C4.1 | v37.78,89.22 37.15,89.85 32.7,89.85 32.38,90.17 27.62,90.17 25.4,87.95 v22.86,87.95
N$6  (via drill 0.51)
  Top 0.254: v33.66,49.85 33.66,49.21 R18.1
  Bottom 0.254: v33.66,49.85 35.88,52.07 43.81,52.07 45.09,53.34 C8.2
N$7  (via drill 0.51)
  Top 0.254: v19.05,55.25 19.05,76.52 R3.1
  Bottom 0.254: v19.05,55.25 20.95,53.34 C3.2
N$8  (via drill 0.51)
  Top 0.254: R18.2 v30.8,50.48 R6.1 | v28.26,50.8 28.26,70.17 IC4.10
  Bottom 0.254: v30.8,50.48 30.48,50.8 v28.26,50.8 18.73,50.8 18.41,50.48 C10.1
N$9  (via drill 0.51)
  Top 0.254: IC4.9 26.99,70.48 26.04,70.48 IC4.8 25.72,70.17 v25.72,68.58 | v12.06,66.99 11.75,66.67 11.75,39.05 11.43,38.73 11.43,29.84 12.7,28.58 C11.1
  Bottom 0.254: v25.72,68.58 24.13,66.99 v12.06,66.99
N$10
  Bottom 0.254: C11.2 9.21,30.48 R17.2
N$11  (via drill 0.51)
  Top 0.254: v2.22,29.53 3.17,28.58 3.17,27.62 2.54,26.99 2.54,21.91 v2.86,21.59
  Bottom 0.254: R17.1 6.99,30.48 3.81,30.48 R20.2 3.81,30.16 3.17,29.53 v2.22,29.53 | v2.86,21.59 2.86,20.32 3.81,19.37 3.81,6.98 MIX.1
N$12  (via drill 0.51)
  Top 0.254: v7.94,39.37 R11.2 | v15.56,6.67 15.24,6.98 v15.24,12.7 | v5.4,13.65 2.54,16.51 v2.54,17.46
  Bottom 0.254: C24.2 12.7,38.42 8.89,38.42 v7.94,39.37 1.27,39.37 1.27,18.73 v2.54,17.46 | v15.56,6.67 13.34,6.67 RELAY.7 | v15.24,12.7 9.84,12.7 8.89,13.65 v5.4,13.65
N$13  (via drill 0.51)
  Top 0.254: v18.73,20 18.1,20.64 18.1,22.23 18.41,22.54 v18.41,27.62 | v7.62,24.77 7.62,20.64 6.35,19.37 6.35,10.79 5.08,9.53 5.08,6.35 5.71,5.71 7.3,5.71 8.57,6.98 MIX.3
  Bottom 0.254: R19.2 14.29,19.69 16.83,19.69 R4.1 17.14,19.69 17.46,20 v18.73,20 | v18.41,27.62 12.38,27.62 9.53,24.77 v7.62,24.77
N$14  (via drill 0.51)
  Top 0.254: v16.83,23.18 16.51,23.5 16.51,25.4 C13.2
  Bottom 0.254: v16.83,23.18 16.83,21.59 R4.2
N$15  (via drill 0.51)
  Top 0.254: 33.66,66.04 33.66,65.41 31.43,63.18 31.43,56.2 31.11,55.88 R12.2 | v35.24,83.82 34.92,83.5 34.92,71.75 33.66,70.48 IC4.14 33.66,70.17 33.66,66.04 | 33.66,66.04 R10.1
  Bottom 0.254: v35.24,83.82 46.99,83.82 C2.1
N$16  (via drill 0.51)
  Top 0.254: v34.61,41.27 34.61,53.66 32.7,55.56 R12.1
  Bottom 0.254: v34.61,41.27 31.43,38.1 20.95,38.1 19.37,36.51 19.37,34.61 14.29,34.61 13.02,33.34 C24.1
N$17  (via drill 0.51)
  Top 0.254: v20.64,33.34 20.64,32.07 20.95,31.75 R1.2 | C1.1 17.78,31.75 17.78,30.16 17.46,29.84 17.46,27.3 17.78,26.99 17.78,22.86 17.46,22.54 17.46,20.32 17.78,20 17.78,17.14 19.05,15.87 19.05,11.11 20.95,9.21 RELAY.3
  Bottom 0.254: v20.64,33.34 16.51,33.34 C1.1
N$18  (via drill 0.51)
  Top 0.254: v24.45,76.52 24.45,79.69 24.13,80.01 C12.2 | v32.07,74.61 32.07,76.2 IC4.2 | VOLUME.1 3.81,26.04 3.81,29.84 v2.22,31.43 v2.22,44.13 | v19.37,25.72 19.37,29.53 18.41,30.48 v18.41,35.56 | v2.86,71.12 2.22,70.48 v2.22,46.04
  Bottom 0.254: 26.04,74.93 26.35,74.61 v32.07,74.61 | 26.04,74.93 v24.45,76.52 | v2.22,31.43 3.17,31.43 3.81,32.07 R20.1 3.81,32.38 5.4,32.38 8.26,35.24 18.1,35.24 v18.41,35.56 | v19.37,25.72 17.78,24.13 16.19,24.13 14.29,22.23 14.29,21.59 R19.1 | 26.04,74.93 22.23,71.12 v2.86,71.12 | v2.22,44.13 v2.22,46.04
N$19  (via drill 0.51)
  Top 0.254: R10.2 32.07,70.17 IC4.13 32.38,70.48 32.38,73.34 34.29,75.25 34.29,88.58 36.51,90.81 45.09,90.81 v45.09,80.64
  Bottom 0.254: 46.99,80.96 50.48,80.96 50.48,79.38 49.85,78.74 48.58,78.74 48.58,77.79 47.94,77.15 47.31,77.15 46.99,76.84 R9.1 | v45.09,80.64 45.4,80.96 46.99,80.96 | 46.99,80.96 C2.2
N$20  (via drill 0.51)
  Top 0.254: 6.35,26.04 8.57,26.04 VOLUME.3 | 27.3,79.06 26.99,79.38 26.99,80.01 C12.1 | 27.3,79.06 v27.94,78.42 | 27.3,79.06 27.3,88.27 31.75,88.27 33.02,87 33.02,76.84 33.34,76.52 IC4.1 | 6.35,26.04 6.03,26.35 6.03,39.05 4.45,40.64 v4.45,41.59 | v5.71,42.86 5.08,43.5 5.08,80.01 7.62,82.55 7.62,83.82 8.26,84.45 10.16,84.45 10.16,80.33 v9.84,80.01 | 6.35,26.04 VOLUME.2
  Bottom 0.254: R9.2 46.99,78.11 46.67,77.79 44.77,77.79 43.5,76.52 32.38,76.52 30.48,78.42 v27.94,78.42 27.3,79.06 10.79,79.06 v9.84,80.01 | v5.71,42.86 v4.45,41.59
N$21
  Top 0.254: U$3.5 33.34,40.32 33.34,40.64 32.7,41.27 29.84,41.27 29.84,23.5 29.21,22.86 28.57,22.86 28.26,23.18 25.4,23.18 J1.CS
N$22
  Bottom 0.254: U$3.4 39.37,31.75 44.13,31.75 45.09,30.8 45.09,25.08 33.97,25.08 J1.D/C
N$23  (via drill 0.51)
  Top 0.254: v42.86,54.61 43.81,53.66 43.81,50.17 48.26,45.72 J1.T_MOSI
  Bottom 0.254: v42.86,54.61 JP3.8 | J1.MOSI 34.61,23.18 46.67,23.18 J1.T_MOSI
N$24  (via drill 0.51)
  Top 0.254: v36.83,77.47 36.83,85.72 41.91,85.72 IC3.3 | v13.97,80.01 14.29,79.69 14.29,55.25 17.14,52.39 v17.14,42.55
  Bottom 0.254: v36.83,77.47 34.92,79.38 27.94,79.38 27.3,80.01 v13.97,80.01 | v17.14,42.55 16.51,41.91 14.29,41.91 C5.+
N$25  (via drill 0.51)
  Top 0.254: v46.67,52.39 46.67,53.97 43.81,56.83 43.81,58.42 41.59,60.64 41.59,66.67 43.81,68.9 43.81,73.03 42.23,73.03 IC3.13
  Bottom 0.254: v46.67,52.39 44.13,49.85 39.69,49.85 U$3.9
N$26  (via drill 0.51)
  Top 0.254: v53.34,74.3 53.34,80.64 51.44,80.64 IC3.22
  Bottom 0.254: v53.34,74.3 54.29,73.34 54.29,68.58 30.48,68.58 29.53,69.53 23.18,69.53 21.59,67.95 5.08,67.95 1.27,64.14 1.27,43.18 4.76,43.18 6.35,44.77 | JP3.3 20,43.5 7.62,43.5 6.35,44.77 | 6.35,44.77 CTRL3.2
N$27  (via drill 0.51)
  Top 0.254: v47.62,70.48 47.62,69.53 48.26,68.9 C7.2 | v38.73,70.48 39.05,70.8 39.05,75.88 41.27,78.11 | 41.27,78.11 41.91,78.11 IC3.9 41.27,78.11 | 41.27,78.11 X1.1
  Bottom 0.254: v38.73,70.48 v47.62,70.48
N$28
  Top 0.254: R8.2 54.93,69.22 54.93,83.19 52.39,85.72 51.44,85.72 IC3.26 51.12,86.04 50.48,86.04 49.85,86.68 49.85,91.76 50.8,92.71 C9.1
N$29  (via drill 0.51)
  Top 0.254: v49.53,79.69 51.12,79.69 IC3.21 | v7.3,79.38 6.35,78.42 CTRL2.2 | JP3.2 20.32,40.64 20.32,52.7 20.95,53.34 22.86,53.34 22.86,57.78 v20.95,59.69
  Bottom 0.254: v49.53,79.69 39.05,79.69 38.73,80.01 34.92,80.01 34.29,80.64 14.61,80.64 14.29,80.96 8.89,80.96 v7.3,79.38 | v20.95,59.69 18.1,62.55 7.62,62.55 6.35,63.82 CTRL2.2
N$30  (via drill 0.51)
  Top 0.254: v49.53,77.79 49.53,78.11 51.12,78.11 IC3.20 | JP3.1 19.68,38.73 19.68,54.61 20,54.93 v20,77.47
  Bottom 0.254: v49.53,77.79 49.53,75.56 50.16,74.93 50.16,73.66 34.29,73.66 30.48,77.47 v20,77.47 16.51,77.47 15.56,78.42 6.99,78.42 6.35,79.06 CTRL1.2
N$31  (via drill 0.51)
  Top 0.254: v32.38,40.32 32.7,40.01 32.7,25.08 | 32.7,25.08 32.7,24.45 J1.SCK | J1.T_SCK 41.59,23.18 41.59,24.45 40.96,25.08 32.7,25.08
  Bottom 0.254: JP3.6 23.5,47.62 25.08,47.62 v32.38,40.32
N$32  (via drill 0.51)
  Top 0.254: v40.64,24.13 J1.MISO
  Bottom 0.254: JP3.7 21.91,51.75 30.8,51.75 32.7,49.85 32.7,42.23 34.92,42.23 35.56,41.59 35.56,35.56 40.96,35.56 42.23,34.29 44.13,34.29 48.9,29.53 48.9,24.13 | 48.9,24.13 48.9,22.86 49.53,22.86 J1.T_MISO | 48.9,24.13 v40.64,24.13
N$33  (via drill 0.51)
  Top 0.254: v44.13,78.42 44.13,77.15 42.23,77.15 IC3.10
  Bottom 0.254: v44.13,78.42 43.81,78.74 X1.2
N$34
  Top 0.254: U$3.7 40.01,38.73 40.01,27.3 J1.T_CS
N$35  (1 unrouted)
  Bottom 0.406: JP5.2 42.55,63.5 38.48,62.61 JP7.1
N$36  (via drill 0.51)
  Top 0.254: v40.32,48.9 40.32,70.17 41.91,71.75 IC3.14
  Bottom 0.254: v40.32,48.9 42.23,46.99 48.9,46.99 | 48.9,46.99 49.85,46.99 50.8,46.04 E1.6 | E2.6 48.9,34.93 48.9,46.99
N$37
  Top 0.254: IC3.15 51.12,71.75 49.85,70.48 49.85,49.53 50.8,48.58 E1.5 50.8,48.26 48.9,46.36 48.9,37.47 E2.5
N$38  (1 unrouted)
  Bottom 0.406: JP5.1 40.64,60.58 37.85,59.94 JP8.1
N$39  (via drill 0.51)
  Top 0.254: JP4.1 22.54,68.9 22.54,59.06 23.5,58.1 23.5,45.09 22.86,44.45 22.86,36.2 20.95,34.29 19.68,34.29 19.68,30.16 21.27,28.58 v21.27,25.72
  Bottom 0.254: v21.27,25.72 22.23,24.77 29.21,24.77 29.84,24.13 29.84,22.86 29.21,22.86 28.26,21.91 | J1.VCC 21.91,23.18 26.35,23.18 J1.RESET 28.26,21.91 | J1.LED 36.51,20 30.16,20 28.26,21.91
N$40  (via drill 0.51)
  Top 0.254: v48.26,72.39 50.16,74.3 51.12,74.3 IC3.17
  Bottom 0.254: JP9.2 v48.26,72.39
N$41
  Bottom 0.508: 9V.1 D2.A
N$42  (via drill 0.51)
  Top 0.254: v49.21,74.61 49.21,75.56 51.12,75.56 IC3.18
  Bottom 0.254: v49.21,74.61 48.9,74.93 JP9.1
N$43
  Bottom 0.254: U$3.6 41.91,39.37 43.18,40.64 E1.1
N$44  (via drill 0.51)
  Top 0.254: v15.24,2.86 15.24,5.71 14.61,6.35 14.61,9.53 13.97,10.16 11.43,10.16 11.43,11.75 11.11,12.06 11.11,18.41 11.43,18.73 11.43,23.18 10.16,24.45 10.16,26.99 9.21,27.94 v9.21,39.37 | v12.7,42.55 13.02,42.86 v13.02,44.45
  Bottom 0.254: v15.24,2.86 14.29,1.9 12.7,1.9 12.06,2.54 7.94,2.54 6.35,4.13 MIX.2B | v9.21,39.37 12.38,42.55 v12.7,42.55 | JP3.4 v13.02,44.45
N$45  (via drill 0.51)
  Top 0.254: v12.06,17.14 12.06,17.46 13.02,18.41 R7.2 | v21.91,16.19 21.91,17.78 C19.2 | v17.78,83.5 14.92,80.64 14.92,57.78 v15.24,57.47 18.1,54.61 18.1,37.78 v20.32,35.56 | v3.81,20.64 1.91,20.64 1.91,27.62 v2.22,27.94 | v11.11,28.89 10.79,29.21 v10.79,53.97
  Bottom 0.254: v21.91,16.19 20.95,17.14 v12.06,17.14 TINY85.8 8.89,20.32 6.35,20.32 | LED1.A 6.35,3.17 5.71,3.17 5.08,3.81 5.08,8.89 6.99,8.89 8.89,10.79 8.89,12.7 5.08,12.7 4.45,13.33 4.45,17.78 5.4,17.78 6.35,18.73 6.35,20.32 | v17.78,83.5 19.37,83.5 78L05.1 | v15.24,57.47 15.24,55.56 C15.+ 12.38,55.56 v10.79,53.97 | U$3.3 33.02,35.56 v20.32,35.56 | 6.35,20.32 6.03,20.64 v3.81,20.64 | v2.22,27.94 3.17,28.89 v11.11,28.89
N$46  (via drill 0.51)
  Top 0.254: v6.67,9.84 7.62,8.89 v7.62,7.94
  Bottom 0.254: v6.67,9.84 TINY85.3 | v7.62,7.94 7.94,8.26 10.79,8.26 12.7,10.16 15.24,10.16 19.05,13.97 20.95,13.97 RELAY.1
N$47  (via drill 0.51)
  Top 0.254: v14.29,16.19 14.29,18.1 14.61,18.41 R7.1 | TINY85.1 v10.16,15.87
  Bottom 0.254: v14.29,16.19 13.97,15.87 v10.16,15.87
N$48  (via drill 0.51)
  Top 0.254: v5.4,16.19 TINY85.5
  Bottom 0.254: v5.4,16.19 7.3,14.29 13.34,14.29 RELAY.10
N$49  (via drill 0.51)
  Top 0.254: TINY85.2 11.43,7.62 v11.43,4.13
  Bottom 0.254: v11.43,4.13 13.02,2.54 13.65,2.54 15.24,4.13 16.83,4.13 20.32,7.62 22.54,7.62 23.81,8.89 32.07,8.89 36.83,13.65 36.83,18.41 JP2.1
N$50  (via drill 0.51)
  Top 0.254: v15.24,15.24 17.14,13.33 R26.1
  Bottom 0.254: v15.24,15.24 10.79,15.24 10.48,14.92 9.84,14.92 7.62,17.14 TINY85.7
N$51  (via drill 0.51)
  Top 0.254: v17.14,3.17 17.14,11.11 R26.2
  Bottom 0.254: v17.14,3.17 15.24,1.27 LED1.K
N$52  (via drill 0.51)
  Top 0.254: RELAY.4 20.95,6.98 19.68,8.26 19.68,9.53 18.41,10.79 18.41,13.97 v17.78,14.6 17.78,16.19 17.14,16.83 17.14,19.37 14.92,21.59 14.92,26.04 15.24,26.35 15.24,28.89 14.92,29.21 14.92,43.81 13.02,45.72 13.02,80.33 v22.86,90.17
  Bottom 0.254: v17.78,14.6 17.78,13.97 15.56,11.75 13.34,11.75 RELAY.9 | IN.1 33.97,92.39 29.53,92.39 28.26,93.66 28.26,95.57 26.35,95.57 23.18,92.39 23.18,90.17 v22.86,90.17
N$53  (via drill 0.51)
  Top 0.254: IC1.3 27.62,16.19 27.62,13.02 26.99,12.38 v25.4,12.38 | OUT.1 10.79,80.64 10.79,55.25 9.84,54.29 9.84,46.04 10.16,45.72 10.16,27.94 11.43,26.67 11.43,24.13 16.51,19.05 v16.51,16.19 | v20.64,16.19 23.18,13.65 v23.18,12.06
  Bottom 0.254: v25.4,12.38 25.08,12.06 v23.18,12.06 21.27,10.16 19.68,10.16 18.41,8.89 13.34,8.89 RELAY.8 | v20.64,16.19 v16.51,16.19
N$54  (via drill 0.51)
  Top 0.254: v5.08,33.34 5.08,24.77 6.35,23.5 VOLUME.2B
  Bottom 0.254: v5.08,33.34 8.57,36.83 17.14,36.83 20.95,40.64 22.23,40.64 24.77,43.18 24.77,46.99 JP3.5
N$55  (via drill 0.51)
  Top 0.254: v53.34,73.03 51.44,73.03 IC3.16
  Bottom 0.254: v53.34,73.03 49.85,69.53 37.15,69.53 JP9.3
N$56  (via drill 0.51)
  Top 0.254: MIX.3B 8.89,4.13 10.48,2.54 14.29,2.54 14.29,3.17 14.61,3.49 14.61,4.44 13.97,5.08 12.06,5.08 12.06,7.94 8.89,11.11 8.89,23.18 VOLUME.3B | v14.29,28.58 13.97,28.26 13.97,24.77 v13.02,23.81
  Bottom 0.254: U$3.1 34.29,29.21 17.78,29.21 17.14,28.58 v14.29,28.58 | v13.02,23.81 12.7,23.5 8.89,23.5 VOLUME.3B
N$57  (1 unrouted)
N$59
  Top 0.254: E2.1 40.64,30.48 40.64,40.64 U$3.8
N$80
  Top 0.254: U$3.10 35.24,51.12 35.24,66.99 34.92,67.31 34.92,70.8 35.56,71.44 35.56,82.55 36.2,83.19 36.2,86.04 36.83,86.68 36.83,90.17 42.55,90.17 43.81,88.9 43.81,83.5 42.23,83.5 IC3.5
N$82
  Top 0.254: IC1.5 30.16,11.75 30.16,13.65 29.84,13.97 R13.2
N$83
  Top 0.254: R16.A 36.83,16.51 36.51,16.83 36.51,19.05 31.43,19.05 30.48,18.1 30.48,17.46 30.8,17.14 30.8,14.29 31.11,13.97 R13.1
N$84
  Top 0.254: LED2.A 26.67,2.54 32.07,2.54 33.02,3.49 33.02,6.67 33.66,7.3 33.66,13.97 35.56,15.87 ZENER.A
N$87  (via drill 0.51)
  Top 0.254: R5.1 24.45,11.43 25.4,10.48 25.4,6.03 24.13,4.76 LDR.1 | v26.35,56.2 26.04,55.88 v26.04,28.26 | v24.13,15.56 24.45,15.24 R5.1 | R5.1
  Bottom 0.254: JP3.9 22.54,56.2 v26.35,56.2 | v26.04,28.26 24.45,26.67 17.14,26.67 16.83,26.99 15.88,26.99 13.97,25.08 13.97,22.86 13.34,22.86 13.02,22.54 13.02,17.78 21.59,17.78 23.81,15.56 v24.13,15.56

### Text on the board
bNames: 9v | AGND | GND | AGND | AGND | OUT | IN | 1337FX | rev 1.2 | TX-RX-G | + | +